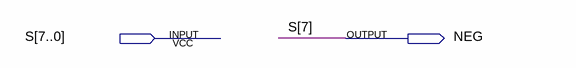
[diagram p0: schematic sheet]
// Quartus schematic NEG.bdf as structural Verilog: 0 symbols, 2 pins
module NEG (
  input  [7:0] S,
  output NEG
);


  assign NEG = S[7];
endmodule
